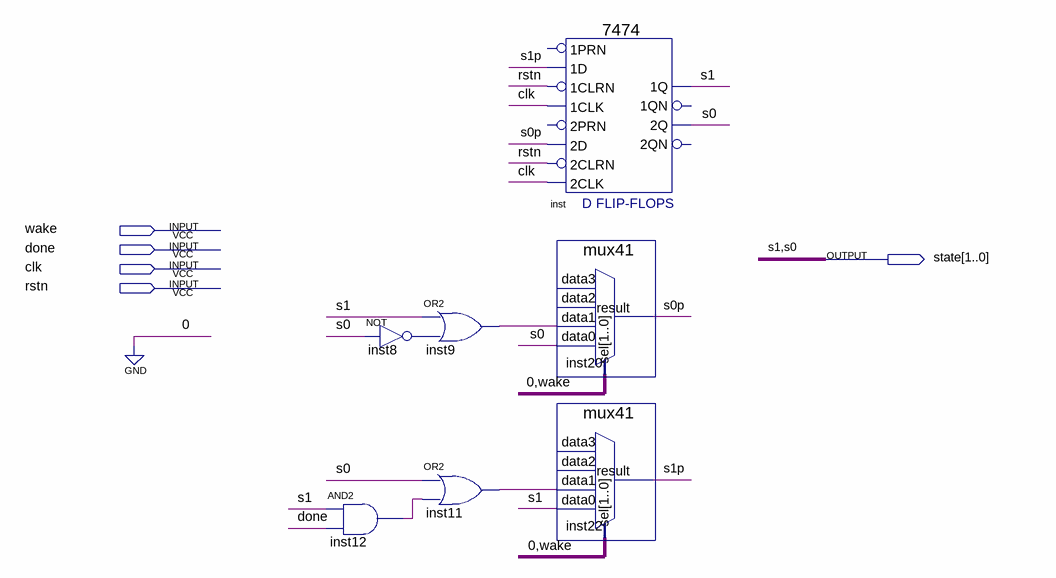
[diagram p0: schematic sheet]
// Quartus schematic Control.bdf as structural Verilog: 7 symbols, 5 pins
module Control (
  input  wake,
  input  done,
  input  clk,
  input  rstn,
  output [1:0] state
);

  wire inst8_out, inst9_out, inst11_out, inst12_out, s0p, s1p;

  and inst12 (inst12_out, state[1], done);
  not inst8 (inst8_out, state[0]);
  or inst9 (inst9_out, state[1], inst8_out);
  or inst11 (inst11_out, state[0], inst12_out);
  \7474  inst (
    .\2D (s0p), .\1CLK (clk), .\1D (s1p), .\2CLK (clk), .\2CLRN (rstn), .\1CLRN (rstn), .\2Q (state[0]),
    .\1Q (state[1]));  // open: 2PRN, 1PRN, 1QN, 2QN
  mux41 inst20 (.data1(inst9_out), .data0(state[0]), .sel({1'b0, wake}), .result(s0p));  // open: data3, data2
  mux41 inst22 (.data1(inst11_out), .data0(state[1]), .sel({1'b0, wake}), .result(s1p));  // open: data3, data2

  // Other names for the same wires on the sheet: s0 = state[0]; s1 = state[1]
endmodule
